# EAGLE design max33xxE_breakout (EAGLE 6.5.0)
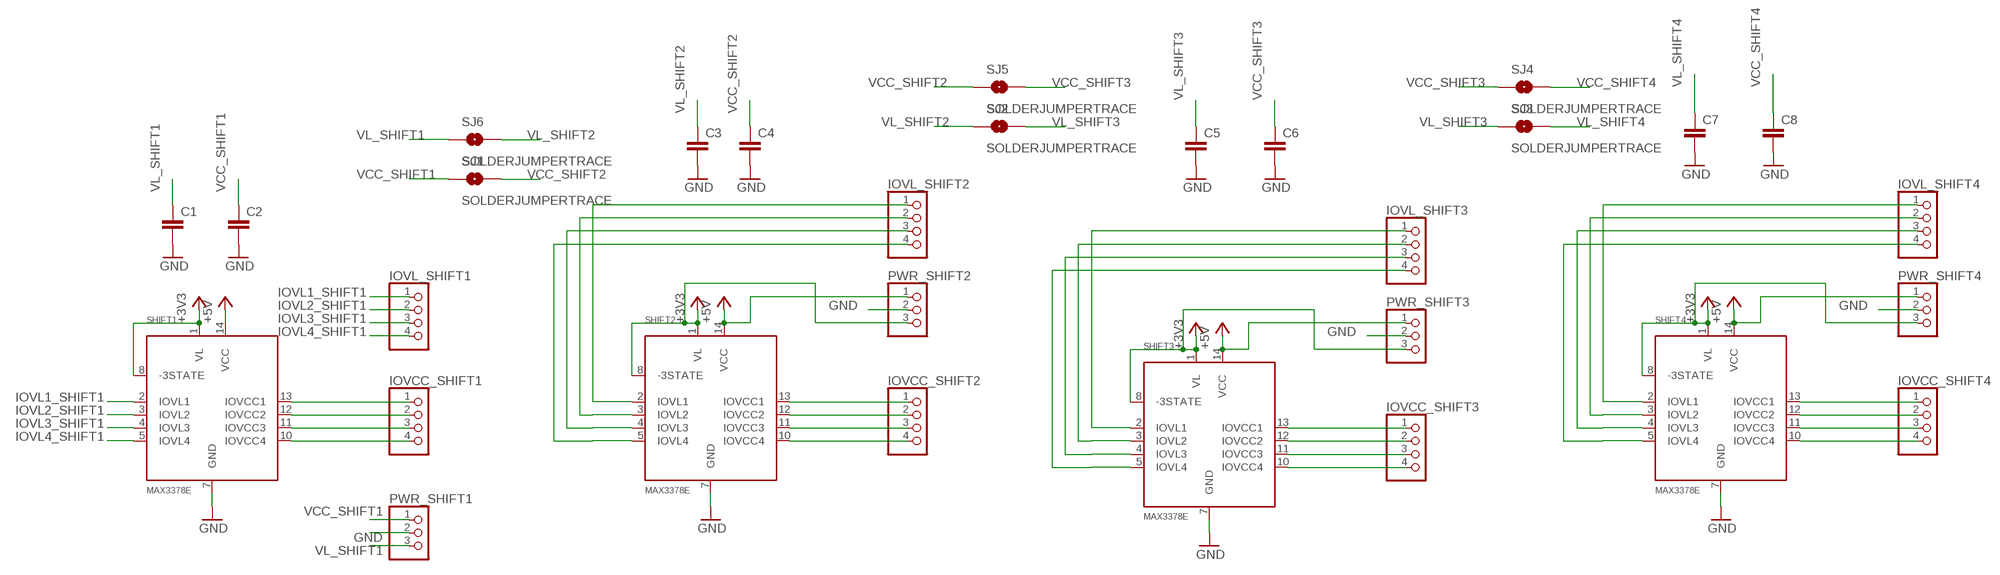
[diagram p0: schematic, sheet 1]

## Parts
C1  C-EUC0603K  [C0603K]
C2  C-EUC0603K  [C0603K]
C3  C-EUC0603K  [C0603K]
C4  C-EUC0603K  [C0603K]
C5  C-EUC0603K  [C0603K]
C6  C-EUC0603K  [C0603K]
C7  C-EUC0603K  [C0603K]
C8  C-EUC0603K  [C0603K]
IOVCC_SHIFT1  PINHD-1X4  [1X04]
IOVCC_SHIFT2  PINHD-1X4  [1X04]
IOVCC_SHIFT3  PINHD-1X4  [1X04]
IOVCC_SHIFT4  PINHD-1X4  [1X04]
IOVL_SHIFT1  PINHD-1X4  [1X04]
IOVL_SHIFT2  PINHD-1X4  [1X04]
IOVL_SHIFT3  PINHD-1X4  [1X04]
IOVL_SHIFT4  PINHD-1X4  [1X04]
PWR_SHIFT1  PINHD-1X3  [1X03]
PWR_SHIFT2  PINHD-1X3  [1X03]
PWR_SHIFT3  PINHD-1X3  [1X03]
PWR_SHIFT4  PINHD-1X3  [1X03]
SHIFT1  MAX3378E  [TSSOP14]
SHIFT2  MAX3378E  [TSSOP14]
SHIFT3  MAX3378E  [TSSOP14]
SHIFT4  MAX3378E  [TSSOP14]
SJ1  SOLDERJUMPERTRACE  [SJ_2S-TRACE]
SJ2  SOLDERJUMPERTRACE  [SJ_2S-TRACE]
SJ3  SOLDERJUMPERTRACE  [SJ_2S-TRACE]
SJ4  SOLDERJUMPERTRACE  [SJ_2S-TRACE]
SJ5  SOLDERJUMPERTRACE  [SJ_2S-TRACE]
SJ6  SOLDERJUMPERTRACE  [SJ_2S-TRACE]

## Nets
+5V: SHIFT1.14(VCC)
GND: C1.2 C2.2 C3.2 C4.2 C5.2 C6.2 C7.2 C8.2 PWR_SHIFT1.2 PWR_SHIFT2.2 PWR_SHIFT3.2 PWR_SHIFT4.2 SHIFT1.7(GND) SHIFT2.7(GND) SHIFT3.7(GND) SHIFT4.7(GND)
IOVCC1_SHIFT1: IOVCC_SHIFT1.1 SHIFT1.13(IOVCC1)
IOVCC1_SHIFT2: IOVCC_SHIFT2.1 SHIFT2.13(IOVCC1)
IOVCC1_SHIFT3: IOVCC_SHIFT3.1 SHIFT3.13(IOVCC1)
IOVCC1_SHIFT4: IOVCC_SHIFT4.1 SHIFT4.13(IOVCC1)
IOVCC2_SHIFT1: IOVCC_SHIFT1.2 SHIFT1.12(IOVCC2)
IOVCC2_SHIFT2: IOVCC_SHIFT2.2 SHIFT2.12(IOVCC2)
IOVCC2_SHIFT3: IOVCC_SHIFT3.2 SHIFT3.12(IOVCC2)
IOVCC2_SHIFT4: IOVCC_SHIFT4.2 SHIFT4.12(IOVCC2)
IOVCC3_SHIFT1: IOVCC_SHIFT1.3 SHIFT1.11(IOVCC3)
IOVCC3_SHIFT2: IOVCC_SHIFT2.3 SHIFT2.11(IOVCC3)
IOVCC3_SHIFT3: IOVCC_SHIFT3.3 SHIFT3.11(IOVCC3)
IOVCC3_SHIFT4: IOVCC_SHIFT4.3 SHIFT4.11(IOVCC3)
IOVCC4_SHIFT1: IOVCC_SHIFT1.4 SHIFT1.10(IOVCC4)
IOVCC4_SHIFT2: IOVCC_SHIFT2.4 SHIFT2.10(IOVCC4)
IOVCC4_SHIFT3: IOVCC_SHIFT3.4 SHIFT3.10(IOVCC4)
IOVCC4_SHIFT4: IOVCC_SHIFT4.4 SHIFT4.10(IOVCC4)
IOVL1_SHIFT1: IOVL_SHIFT1.1 SHIFT1.2(IOVL1)
IOVL1_SHIFT2: IOVL_SHIFT2.1 SHIFT2.2(IOVL1)
IOVL1_SHIFT3: IOVL_SHIFT3.1 SHIFT3.2(IOVL1)
IOVL1_SHIFT4: IOVL_SHIFT4.1 SHIFT4.2(IOVL1)
IOVL2_SHIFT1: IOVL_SHIFT1.2 SHIFT1.3(IOVL2)
IOVL2_SHIFT2: IOVL_SHIFT2.2 SHIFT2.3(IOVL2)
IOVL2_SHIFT3: IOVL_SHIFT3.2 SHIFT3.3(IOVL2)
IOVL2_SHIFT4: IOVL_SHIFT4.2 SHIFT4.3(IOVL2)
IOVL3_SHIFT1: IOVL_SHIFT1.3 SHIFT1.4(IOVL3)
IOVL3_SHIFT2: IOVL_SHIFT2.3 SHIFT2.4(IOVL3)
IOVL3_SHIFT3: IOVL_SHIFT3.3 SHIFT3.4(IOVL3)
IOVL3_SHIFT4: IOVL_SHIFT4.3 SHIFT4.4(IOVL3)
IOVL4_SHIFT1: IOVL_SHIFT1.4 SHIFT1.5(IOVL4)
IOVL4_SHIFT2: IOVL_SHIFT2.4 SHIFT2.5(IOVL4)
IOVL4_SHIFT3: IOVL_SHIFT3.4 SHIFT3.5(IOVL4)
IOVL4_SHIFT4: IOVL_SHIFT4.4 SHIFT4.5(IOVL4)
VCC_SHIFT1: C2.1 PWR_SHIFT1.1 SJ1.1
VCC_SHIFT2: C4.1 PWR_SHIFT2.1 SHIFT2.14(VCC) SJ1.2 SJ5.1 ; supply symbol labelled +5V
VCC_SHIFT3: C6.1 PWR_SHIFT3.1 SHIFT3.14(VCC) SJ4.1 SJ5.2 ; supply symbol labelled +5V
VCC_SHIFT4: C8.1 PWR_SHIFT4.1 SHIFT4.14(VCC) SJ4.2 ; supply symbol labelled +5V
VL_SHIFT1: C1.1 PWR_SHIFT1.3 SHIFT1.1(VL) SHIFT1.8(-3STATE) SJ6.1 ; supply symbol labelled +3V3
VL_SHIFT2: C3.1 PWR_SHIFT2.3 SHIFT2.1(VL) SHIFT2.8(-3STATE) SJ2.1 SJ6.2 ; supply symbol labelled +3V3
VL_SHIFT3: C5.1 PWR_SHIFT3.3 SHIFT3.1(VL) SHIFT3.8(-3STATE) SJ2.2 SJ3.1 ; supply symbol labelled +3V3
VL_SHIFT4: C7.1 PWR_SHIFT4.3 SHIFT4.1(VL) SHIFT4.8(-3STATE) SJ3.2 ; supply symbol labelled +3V3

## Library data of the parts
C1-C8 = rcl:C-EU: CAPACITOR, European symbol
IOVCC_SHIFT1-IOVCC_SHIFT4 IOVL_SHIFT1-IOVL_SHIFT4 = pinhead:PINHD-1X4: PIN HEADER
PWR_SHIFT1-PWR_SHIFT4 = pinhead:PINHD-1X3: PIN HEADER
SHIFT1-SHIFT4 = max33xxE_lvl_shifters:MAX3378E: MAX3378E/MAX3377E Bi-directional 4-bit low-voltage level translator MAX3378E has 8Mbps max speed. MAX3377E has 230kbps max speed
SJ1-SJ6 = SparkFun-Passives:SOLDERJUMPER: Solder Jumper Standard SMD solder jumper. Used to automate production. Two varients : Normally Open and Normally Closed are the same, but have different paste layers. NC will have a large amount of paste and should jumper during reflow.

## Board
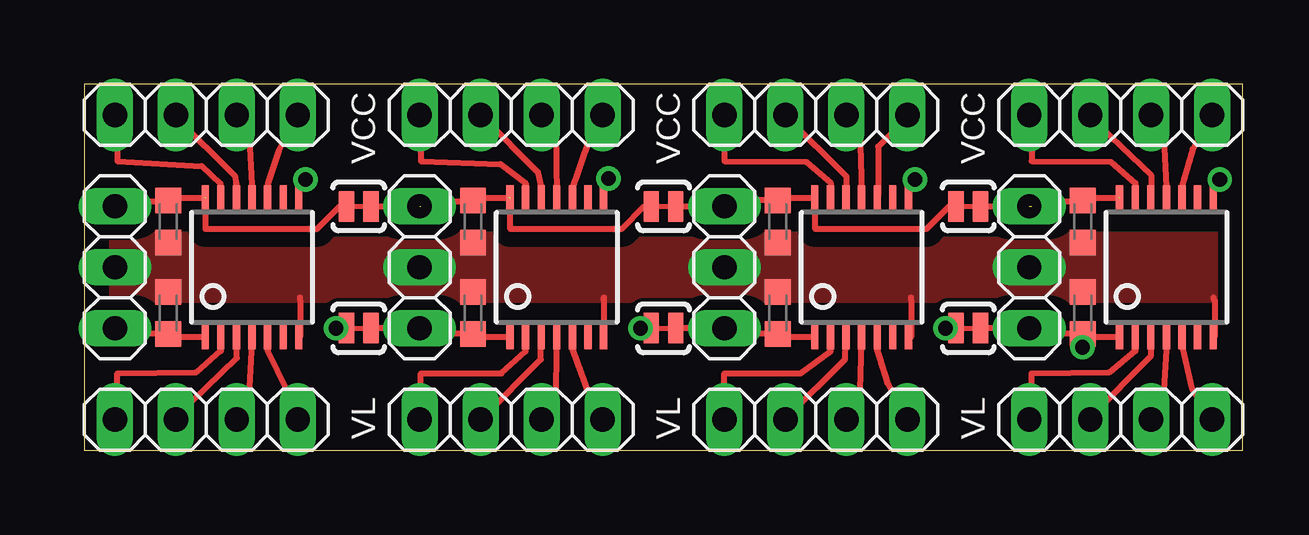
[diagram p1: board, top side]
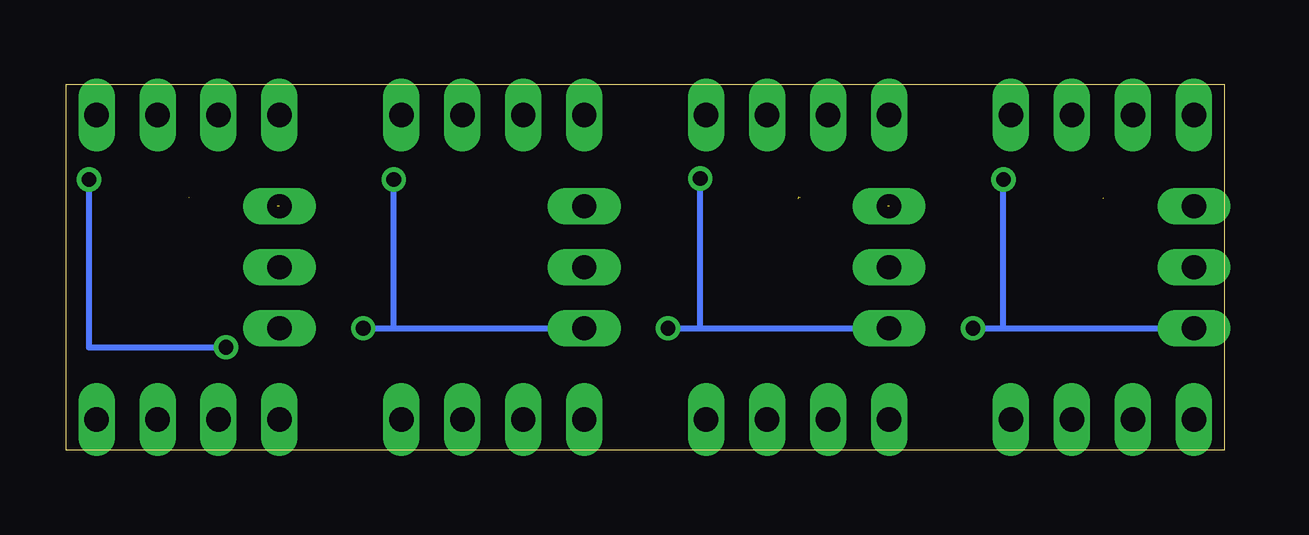
[diagram p2: board, bottom side, seen from below]

Size 48.26 x 15.24 mm. Coordinates in mm from the lower left corner, seen from the top.
Outline: 0,0 48.26,0 48.26,15.24 0,15.24 0,0
Copper layers (1*16): Top 0.035mm / dielectric 1.5mm / Bottom 0.035mm
Design rules "default": minimum track width 10mil, minimum drill 24mil, track to track 8mil, track to pad 8mil, pad to pad 8mil, via to via 8mil, smd to smd 8mil, copper to edge 40mil, drill to drill 8mil, minimum pad ring 10mil, minimum via ring 8mil, stop-mask expansion 4mil, vias tented up to drill 0mil, thermal gap 10mil

### Footprints (pad centres in the part's own frame; a part is rotated, then mirrored left to right if it is on the bottom)
C0603K = smd 1.05 x 1.08: 1 -0.875,0; 2 0.875,0
1X04 = drill 1.016 long: 1 -3.81,0; 2 -1.27,0; 3 1.27,0; 4 3.81,0
1X03 = drill 1.016 long: 1 -2.54,0; 2 0,0; 3 2.54,0
TSSOP14 = smd 0.305 x 0.991: 1 -1.95,-2.918; 2 -1.3,-2.918; 3 -0.65,-2.918; 4 0,-2.918; 5 0.65,-2.918; 6 1.3,-2.918; 7 1.95,-2.918; 8 1.95,2.918; 9 1.3,2.918; 10 0.65,2.918; 11 0,2.918; 12 -0.65,2.918; 13 -1.3,2.918; 14 -1.95,2.918
SJ_2S-TRACE = smd 0.635 x 1.27: 1 -0.508,0; 2 0.508,0

### Placement (x,y rotation side)
C1  3.49,5.71 90 top
C2  3.49,9.53 270 top
C3  16.19,5.71 90 top
C4  16.19,9.53 270 top
C5  28.89,5.71 90 top
C6  28.89,9.53 270 top
C7  41.59,5.71 90 top
C8  41.59,9.53 270 top
IOVCC_SHIFT1  5.08,13.97 0 top
IOVCC_SHIFT2  17.78,13.97 0 top
IOVCC_SHIFT3  30.48,13.97 0 top
IOVCC_SHIFT4  43.18,13.97 0 top
IOVL_SHIFT1  5.08,1.27 0 top
IOVL_SHIFT2  17.78,1.27 0 top
IOVL_SHIFT3  30.48,1.27 0 top
IOVL_SHIFT4  43.18,1.27 0 top
PWR_SHIFT1  1.27,7.62 270 top
PWR_SHIFT2  13.97,7.62 270 top
PWR_SHIFT3  26.67,7.62 270 top
PWR_SHIFT4  39.37,7.62 270 top
SHIFT1  6.99,7.62 0 top
SHIFT2  19.68,7.62 0 top
SHIFT3  32.38,7.62 0 top
SHIFT4  45.09,7.62 0 top
SJ1  11.43,10.16 0 top
SJ2  24.13,5.08 0 top
SJ3  36.83,5.08 0 top
SJ4  36.83,10.16 0 top
SJ5  24.13,10.16 0 top
SJ6  11.43,5.08 0 top

### Tracks (layer width: path | path; a pad name or v marks a point on that pad's centre or on a via)
GND
  Top 0.254: SHIFT1.7 8.99,4.72 8.99,6.25 8.99,6.35 | SHIFT2.7 21.64,4.72 21.64,6.25 21.64,6.35 | SHIFT3.7 34.44,4.72 34.44,6.25 34.44,6.35 | SHIFT4.7 47.09,4.72 47.09,6.25 47.04,6.35
  pour Top (isolate 0.61, no thermals): 0,8.89 0,6.35 48.26,6.35 48.26,8.89
IOVCC1_SHIFT1
  Top 0.254: SHIFT1.13 5.66,10.62 5.66,11.1 4.89,11.84 1.37,12.04 1.37,13.87 IOVCC_SHIFT1.1
IOVCC1_SHIFT2
  Top 0.254: SHIFT2.13 18.39,10.67 18.39,11.12 17.35,11.91 14.02,12.04 14.02,13.87 IOVCC_SHIFT2.1
IOVCC1_SHIFT3
  Top 0.254: SHIFT3.13 31.09,11.15 30.07,12.01 26.67,12.04 26.67,13.87 IOVCC_SHIFT3.1
IOVCC1_SHIFT4
  Top 0.254: SHIFT4.13 43.79,10.67 43.79,11.12 42.77,12.01 39.47,12.04 39.47,13.87 IOVCC_SHIFT4.1
IOVCC2_SHIFT1
  Top 0.254: SHIFT1.12 6.33,11.1 6.27,11.43 3.81,13.87 IOVCC_SHIFT1.2
IOVCC2_SHIFT2
  Top 0.254: SHIFT2.12 19.05,10.82 18.9,11.58 16.61,13.87 IOVCC_SHIFT2.2
IOVCC2_SHIFT3
  Top 0.254: SHIFT3.12 31.75,10.64 31.75,11.4 29.26,13.87 IOVCC_SHIFT3.2
IOVCC2_SHIFT4
  Top 0.254: SHIFT4.12 44.45,10.82 44.45,11.46 41.91,13.87 IOVCC_SHIFT4.2
IOVCC3_SHIFT1
  Top 0.254: SHIFT1.11 6.99,10.67 6.86,13.41 6.4,13.87 IOVCC_SHIFT1.3
IOVCC3_SHIFT2
  Top 0.254: SHIFT2.11 19.68,10.67 19.63,13.28 19.05,13.87 IOVCC_SHIFT2.3
IOVCC3_SHIFT3
  Top 0.254: SHIFT3.11 32.38,10.69 32.31,13.41 31.85,13.87 IOVCC_SHIFT3.3
IOVCC3_SHIFT4
  Top 0.254: SHIFT4.11 45.09,10.97 44.96,13.41 44.5,13.87 IOVCC_SHIFT4.3
IOVCC4_SHIFT1
  Top 0.254: SHIFT1.10 7.64,11.12 8.1,12.5 8.84,13.87 IOVCC_SHIFT1.4
IOVCC4_SHIFT2
  Top 0.254: SHIFT2.10 20.34,10.97 20.95,12.72 21.49,13.87 IOVCC_SHIFT2.4
IOVCC4_SHIFT3
  Top 0.254: SHIFT3.10 33.07,10.67 33.07,12.65 34.29,13.87 IOVCC_SHIFT3.4
IOVCC4_SHIFT4
  Top 0.254: SHIFT4.10 45.72,10.97 46.18,12.55 46.94,13.87 IOVCC_SHIFT4.4
IOVL1_SHIFT1
  Top 0.254: SHIFT1.2 5.69,4.6 5.69,4.14 4.67,3.25 1.37,3.2 1.37,1.37 IOVL_SHIFT1.1
IOVL1_SHIFT2
  Top 0.254: SHIFT2.2 18.39,4.57 18.39,4.12 17.37,3.2 14.02,3.2 14.02,1.37 IOVL_SHIFT2.1
IOVL1_SHIFT3
  Top 0.254: SHIFT3.2 31.09,4.57 31.09,4.12 29.84,3.2 26.67,3.2 26.67,1.37 IOVL_SHIFT3.1
IOVL1_SHIFT4
  Top 0.254: SHIFT4.2 43.79,4.55 43.79,4.14 42.72,3.25 39.47,3.2 39.47,1.37 IOVL_SHIFT4.1
IOVL2_SHIFT1
  Top 0.254: SHIFT1.3 6.35,4.6 6.35,3.83 3.81,1.37 IOVL_SHIFT1.2
IOVL2_SHIFT2
  Top 0.254: SHIFT2.3 19.02,4.7 19.02,3.79 16.61,1.37 IOVL_SHIFT2.2
IOVL2_SHIFT3
  Top 0.254: SHIFT3.3 31.73,4.5 31.7,3.79 29.26,1.37 IOVL_SHIFT3.2
IOVL2_SHIFT4
  Top 0.254: SHIFT4.3 44.45,4.57 44.45,3.94 41.91,1.37 IOVL_SHIFT4.2
IOVL3_SHIFT1
  Top 0.254: SHIFT1.4 6.99,4.52 6.86,1.83 6.4,1.37 IOVL_SHIFT1.3
IOVL3_SHIFT2
  Top 0.254: SHIFT2.4 19.68,4.52 19.66,1.98 19.05,1.37 IOVL_SHIFT2.3
IOVL3_SHIFT3
  Top 0.254: SHIFT3.4 32.38,4.52 32.31,1.83 31.85,1.37 IOVL_SHIFT3.3
IOVL3_SHIFT4
  Top 0.254: SHIFT4.4 45.11,4.52 44.96,1.83 44.5,1.37 IOVL_SHIFT4.3
IOVL4_SHIFT1
  Top 0.254: SHIFT1.5 7.64,4.14 8.48,2.44 8.84,1.37 IOVL_SHIFT1.4
IOVL4_SHIFT2
  Top 0.254: SHIFT2.5 20.32,4.27 20.98,2.49 21.49,1.37 IOVL_SHIFT2.4
IOVL4_SHIFT3
  Top 0.254: SHIFT3.5 33.02,4.27 33.5,2.74 34.29,1.37 IOVL_SHIFT3.4
IOVL4_SHIFT4
  Top 0.254: SHIFT4.5 45.72,4.47 46.15,2.56 46.94,1.37 IOVL_SHIFT4.4
VCC_SHIFT1  (1 unrouted)
  Top 0.254: 5.03,10.52 3.5,10.52 C2.1 3.35,10.36 1.37,10.36 1.37,10.21 PWR_SHIFT1.1 | SJ1.1 10.64,10.16 9.68,9.21 8.97,9.21 5.05,9.21 5.05,10.49
VCC_SHIFT2  (3 unrouted)
  Top 0.254: 17.68,10.52 16.31,10.52 C4.1 16.15,10.36 14.02,10.36 14.02,10.21 14.02,10.16 SJ1.2 | SJ5.1 23.34,10.16 22.38,9.21 21.67,9.21 17.75,9.21 17.75,10.47
VCC_SHIFT3
  Top 0.254: 24.64,10.36 SJ5.2 PWR_SHIFT3.1 26.8,10.16 26.8,10.44 28.89,10.44 C6.1 28.96,10.52 30.33,10.52 SHIFT3.14 30.45,10.52 30.45,9.21 34.37,9.21 35.08,9.21 36.04,10.16 SJ4.1
VCC_SHIFT4  (2 unrouted)
  Top 0.254: 43.13,10.52 41.6,10.52 C8.1 41.45,10.36 39.47,10.36 39.47,10.21 39.47,10.16 SJ4.2
VL_SHIFT1  (via drill 0.61)
  Top 0.254: SHIFT1.1 5.03,4.72 3.5,4.72 C1.1 3.35,4.88 1.37,4.88 1.37,5.03 PWR_SHIFT1.3 | v10.48,5.08 SJ6.1 | v9.21,11.27 8.94,11.27 SHIFT1.8
  Bottom 0.254: PWR_SHIFT1.3 v10.48,5.08 9.21,5.08 v9.21,11.27
VL_SHIFT2  (via drill 0.61)
  Top 0.254: SHIFT2.1 17.68,4.72 16.31,4.72 C3.1 16.15,4.88 14.02,4.88 14.02,5.03 PWR_SHIFT2.3 SJ6.2 | v23.18,5.08 SJ2.1 | v21.84,11.32 21.64,11.32 SHIFT2.8
  Bottom 0.254: PWR_SHIFT2.3 v23.18,5.08 21.84,5.08 v21.84,11.32
VL_SHIFT3  (via drill 0.61)
  Top 0.254: SHIFT3.1 30.33,4.72 28.96,4.72 C5.1 28.8,4.88 26.67,4.88 26.67,5.03 PWR_SHIFT3.3 SJ2.2 | v35.88,5.08 SJ3.1 | v34.61,11.27 34.34,11.27 SHIFT3.8
  Bottom 0.254: PWR_SHIFT3.3 v35.88,5.08 34.61,5.08 v34.61,11.27
VL_SHIFT4  (via drill 0.61)
  Top 0.254: SHIFT4.1 43.13,4.72 41.6,4.72 C7.1 | C7.1 41.45,4.88 39.47,4.88 39.47,5.03 PWR_SHIFT4.3 SJ3.2 | v47.31,11.27 47.03,11.27 SHIFT4.8 | v41.59,4.29 C7.1
  Bottom 0.254: v47.31,11.27 47.31,4.29 v41.59,4.29

### Text on the board
tNames: VCC | VCC | VCC | VL | VL | VL